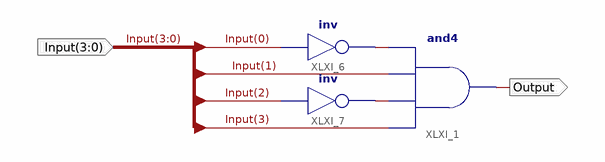
[diagram p0: schematic sheet 1]
// Xilinx ISE schematic BCDCap.sch (spartan6) as structural Verilog: 3 symbols, 2 ports
module BCDCap (
  input  [3:0] Input,
  output Output
);

  wire XLXN_9, XLXN_10;

  and XLXI_1 (Output, Input[3], XLXN_10, Input[1], XLXN_9);
  not XLXI_6 (XLXN_9, Input[0]);
  not XLXI_7 (XLXN_10, Input[2]);
endmodule
